# Altium schematic sheet Controller_Sheet.SchDoc
size 420 x 297 mm; SheetNumber: 2; SheetTotal: 4
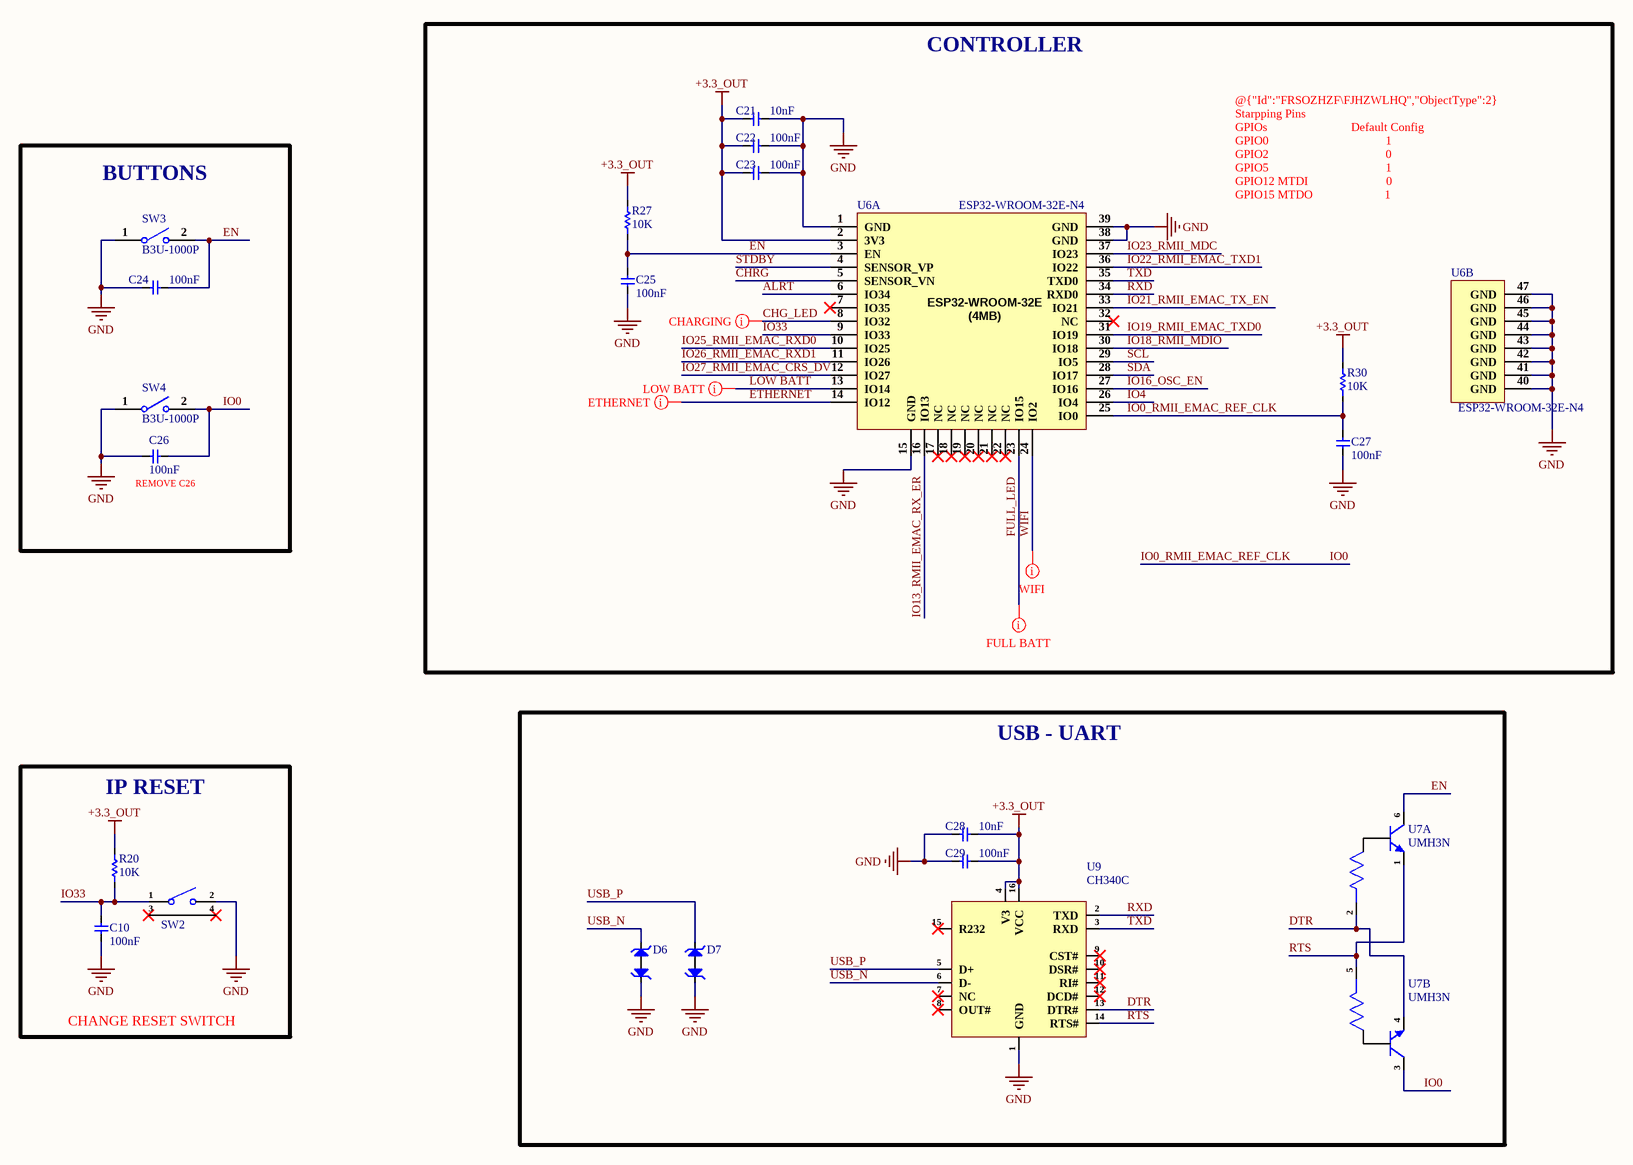
[diagram p0: Controller_Sheet.SchDoc]

## Parts
C10  100nF  [cap-0402]
C21  10nF  [Cap-0402]
C22  100nF  [cap-0402]
C23  100nF  [cap-0402]
C24  100nF  [cap-0402]
C25  100nF  [cap-0402]
C26  100nF  [cap-0402]
C27  100nF  [cap-0402]
C28  10nF  [Cap-0402]
C29  100nF  [cap-0402]
D6  PESD5V0H1BSFYL  [DSN0603-2]  (value not drawn)
D7  PESD5V0H1BSFYL  [DSN0603-2]  (value not drawn)
R20  10K  [Res-0402]
R27  10K  [Res-0402]
R30  10K  [Res-0402]
SW2  1-1825027-4  [1-1825027-4]  (value not drawn)
SW3  B3U-1000P  [B3U-1000P]
SW4  B3U-1000P  [B3U-1000P]
U6  ESP32-WROOM-32E-N4  [38-SMD Module]  (parts A,B of 2)
U7  UMH3N  [SC-70-6_]  (parts A,B of 2)
U9  CH340C  [SOP-16]

## Blocks framed on the sheet
CONTROLLER: C21-C23 C25 C27 R27 R30 U6
BUTTONS: C24 C26 SW3 SW4
USB - UART: C28 C29 D6 D7 U7 U9
IP RESET: C10 R20 SW2

## Nets
+3.3_OUT: C21.2 C22.2 C23.2 C28.1 C29.1 R20.2 R27.2 R30.2 U6.2(3V3) U9.4(V3) U9.16(VCC)
GND: C10.2 C21.1 C22.1 C23.1 C24.2 C25.1 C26.2 C27.1 C28.2 C29.2 D6.1 D7.1 SW2.2 SW3.1 SW4.1 U6.1(GND) U6.15(GND) U6.38(GND) U6.39(GND) U6.40(GND) U6.41(GND) U6.42(GND) U6.43(GND) U6.44(GND) U6.45(GND) U6.46(GND) U6.47(GND) U9.1(GND)
ALRT: U6.6(IO34)
CHG_LED: U6.8(IO32)
CHRG: U6.5(SENSOR_VN)
DTR: U7.2 U7.4(E) U9.13(DTR#)
EN: C24.1 C25.2 R27.1 SW3.2 U6.3(EN) U7.6(C)
ETHERNET: U6.14(IO12)
FULL_LED: U6.23(IO15)
IO0: C26.1 C27.2 R30.1 SW4.2 U6.25(IO0) U7.3(C)  [also labelled IO0_RMII_EMAC_REF_CLK]
IO4: U6.26(IO4)
IO13_RMII_EMAC_RX_ER: U6.16(IO13)
IO16_OSC_EN: U6.27(IO16)
IO18_RMII_MDIO: U6.30(IO18)
IO19_RMII_EMAC_TXD0: U6.31(IO19)
IO21_RMII_EMAC_TX_EN: U6.33(IO21)
IO22_RMII_EMAC_TXD1: U6.36(IO22)
IO23_RMII_MDC: U6.37(IO23)
IO25_RMII_EMAC_RXD0: U6.10(IO25)
IO26_RMII_EMAC_RXD1: U6.11(IO26)
IO27_RMII_EMAC_CRS_DV: U6.12(IO27)
IO33: C10.1 R20.1 SW2.1 U6.9(IO33)
LOW BATT: U6.13(IO14)
RTS: U7.1(E) U7.5 U9.14(RTS#)
RXD: U6.34(RXD0) U9.2(TXD)
SCL: U6.29(IO5)
SDA: U6.28(IO17)
STDBY: U6.4(SENSOR_VP)
TXD: U6.35(TXD0) U9.3(RXD)
USB_N: D6.2 U9.6(D-)
USB_P: D7.2 U9.5(D+)
WIFI: U6.24(IO2)

Not connected (* = marked no-connect by the designer): SW2 3* 4*; U6 7(IO35)* 17(NC)* 18(NC)* 19(NC)* 20(NC)* 21(NC)* 22(NC)* 32(NC)*; U9 7(NC)* 8(OUT#)* 9(CST#)* 10(DSR#)* 11(RI#)* 12(DCD#)* 15(R232)*

## Layout directives
mark named FULL BATT: FULL_LED
mark named LOW BATT: LOW BATT
mark named ETHERNET: ETHERNET
mark named WIFI: WIFI
mark named CHARGING: CHG_LED

## Notes on the sheet
- @{"Id":"FRSOZHZF\FJHZWLHQ","ObjectType":2} Starpping Pins
  GPIOs                            Default Config
  GPIO0                                       1
  GPIO2                                       0
  GPIO5                                       1
  GPIO12 MTDI                          0
  GPIO15 MTDO                        1
- (near C26) REMOVE C26
- CHANGE RESET SWITCH
- PROJECT
- TITLE
- SCALE:
- A3
- SIZE
- FILE NAME
- SHEET
- OF
- REV
- (in symbol ESP32-WROOM-32E-N4, part A) ESP32-WROOM-32E (4MB) /

## Library data of the parts
C10 C22-C27 C29 = C1005X7R1H104KT000F: CAP CER 0.1UF 50V X7R 0402; Manufacturer: TDK; Tolerance: 10%; Voltage: 25V; Item Type: Capacitor; Supplier 1: Avnet; Manufacturer Part Number: C1005X7R1H104KT000F; RoHS: No; Category: Ceramic Capacitors; Dielectric: X7R; Supplier Part Number 1: C1005X7R1H104KT000F; LCSC Part Number: C361198; ComponentLink1Description: LCSC; ComponentLink1URL: https://www.lcsc.com/product-detail/Multilayer-Ceramic-Capacitors-MLCC-SMD-SMT_TDK-C1005X7R1H104KT000F_C361198.html
C21 C28 = CC0402KRX7R8BB103: CAP CER 10000PF 25V X7R 0402; Manufacturer: Yageo; Tolerance: 10%; Item Type: Capacitor; Supplier 1: Digi-Key; Manufacturer Part Number: CC0402KRX7R8BB103; Stock 1: 0; Pricing 1: 1=0.1, 10=0.021, 100=0.0093, 500=0.00666, 1000=0.00523, 2500=0.00476, 5000=0.00438 (USD); Mount: Surface Mount; Case/Package: 0402; Case Code (Metric): 1005; Case Code (Imperial): 0402; Min Operating Temperature: -55°C; Max Operating Temperature: 125°C; Capacitance: 10nF; Dielectric: X7R; Voltage Rating: 25V; Package Quantity: 1; Packaging: Tape and Reel; Voltage Rating (DC): 25V; Termination: SMD/SMT; Composition: Ceramic; Length: 1mm; Height: 0.5mm; Depth: 0.5mm; Width: 0.02inch; Thickness: 0.022inch; Radiation Hardening: No; REACH SVHC: Unknown; Lead Free: Lead Free; Halogen Free: Halogen Free; ComponentLink1URL: http://www.yageo.com/documents/recent/UPY-GPHC_X7R_6.3V-to-50V_18.pdf?src-supplier=Digi-Key; ComponentLink1Description: http://www.yageo.com/documents/recent/UPY-GPHC_X7R_6.3V-to-50V_18.pdf?src-supplier=Digi-Key; ComponentLink2URL: https://www.verical.com/server-webapp/html/getDatasheet?partID=375418&src-supplier=Verical; ComponentLink2Description: https://www.verical.com/server-webapp/html/getDatasheet?partID=375418&src-supplier=Verical; ComponentLink3URL: http://www.yageo.com/documents/recent/UPY-GPHC_X7R_6.3V-to-50V_8.pdf?src-supplier=Avnet; ComponentLink3Description: http://www.yageo.com/documents/recent/UPY-GPHC_X7R_6.3V-to-50V_8.pdf?src-supplier=Avnet; ComponentLink4URL: https://4donline.ihs.com/images/VipMasterIC/IC/YAGO/YAGO-S-A0003557223/YAGO-S-A0003557223-1.pdf?hkey=52A5661711E402568146F3353EA87419&src-supplier=Element14; ComponentLink4Description: https://4donline.ihs.com/images/VipMasterIC/IC/YAGO/YAGO-S-A0003557223/YAGO-S-A0003557223-1.pdf?hkey=52A5661711E402568146F3353EA87419&src-supplier=Element14; ComponentLink5URL: http://www.farnell.com/datasheets/2167236.pdf?src-supplier=Element14; ComponentLink5Description: http://www.farnell.com/datasheets/2167236.pdf?src-supplier=Element14; ComponentLink6URL: http://www.mouser.com/ds/2/447/Yageo_UPY-GP_NP0_16V-to-50V_9-358835.pdf?src-supplier=Mouser; ComponentLink6Description: http://www.mouser.com/ds/2/447/Yageo_UPY-GP_NP0_16V-to-50V_9-358835.pdf?src-supplier=Mouser; Supplier Part Number 1: 311-1337-1-ND; LCSC Part Number: C327025
D6 D7 = PESD5V0H1BSFYL: TVS DIODE 5VWM 6.3VC DSN0603-2; Manufacturer: Nexperia; Supplier 1: Avnet; Manufacturer Part Number: PESD5V0H1BSFYL; RoHS: Yes; Category: ESD and Circuit Protection ICs; Stock 1: 9000; Pricing 1: 18000=0.06453, 36000=0.06278, 54000=0.06104, 90000=0.05930, 180000=0.05755, 900000=0.05581, 1800000=0.05406 (USD); RoHS Compliant: Yes; ComponentLink1URL: http://www.farnell.com/datasheets/1961312.pdf?src-supplier=Farnell; ComponentLink1Description: http://www.farnell.com/datasheets/1961312.pdf?src-supplier=Farnell; ComponentLink2URL: https://assets.nexperia.com/documents/data-sheet/PESD5V0H1BSF.pdf?src-supplier=Digi-Key; ComponentLink2Description: https://assets.nexperia.com/documents/data-sheet/PESD5V0H1BSF.pdf?src-supplier=Digi-Key; ComponentLink3URL: http://www.farnell.com/datasheets/1961312.pdf?src-supplier=Newark; ComponentLink3Description: http://www.farnell.com/datasheets/1961312.pdf?src-supplier=Newark; Supplier Part Number 1: PESD5V0H1BSFYL; LCSC Part Number: C477989; Item Type: Diode
R20 R27 R30 = RC0402FR-0710KL: RES 10K OHM 1% 1/16W 0402; Manufacturer: Yageo; Resistance: 10kR; Voltage Rating (DC): 50V; Temperature Coefficient: 100ppm/°C; Power Rating: 62.5mW; Max Power Dissipation: 63mW; Item Type: Resistor; Supplier 1: Mouser; Manufacturer Part Number: RC0402FR-0710KL; RoHS: Yes; Category: Chip SMD Resistors; Stock 1: 18648329; Pricing 1: 1=0.10000, 10=0.01400, 50=0.01400, 100=0.00500, 1000=0.00300, 10000=0.00200 (USD); Case/Package: 0402; Number of Pins: 2; Case Code (Imperial): 0402; Case Code (Metric): 1005; Min Operating Temperature: -55°C; Max Operating Temperature: 155°C; Resistor Type: Thick Film; Tolerance: 1%; Packaging: Tape and Reel; Voltage Rating: 50V; Termination: SMD/SMT; Working Voltage: 50V; Number of Terminations: 2; Features: Moisture Resistant; Series: RC; Resistance Tolerance: 1%; Construction: Rectangular; Length: 1mm; Width: 0.5mm; Height: 0.32mm; Depth: 0.5mm; Lead Pitch: 0.2mm; REACH SVHC: No SVHC; Lead Free: Lead Free; RoHS Compliant: Yes; Military Standard: Not; ComponentLink1URL: https://datasheet.ciiva.com/7660/38568-7660787.pdf?src-supplier=Element14; ComponentLink1Description: https://datasheet.ciiva.com/7660/38568-7660787.pdf?src-supplier=Element14; ComponentLink2URL: https://datasheet.ciiva.com/7849/1686128-7849814.pdf?src-supplier=Element14; ComponentLink2Description: https://datasheet.ciiva.com/7849/1686128-7849814.pdf?src-supplier=Element14; ComponentLink3URL: https://datasheet.ciiva.com/7983/1018594-7983486.pdf?src-supplier=Element14; ComponentLink3Description: https://datasheet.ciiva.com/7983/1018594-7983486.pdf?src-supplier=Element14; ComponentLink4URL: https://datasheet.ciiva.com/22747/1018594-22747512.pdf?src-supplier=Element14; ComponentLink4Description: https://datasheet.ciiva.com/22747/1018594-22747512.pdf?src-supplier=Element14; ComponentLink5URL: https://datasheet.ciiva.com/12667/pyu-rc0402-51-rohs-l-6-r-12667067.pdf?src-supplier=Mouser; ComponentLink5Description: https://datasheet.ciiva.com/12667/pyu-rc0402-51-rohs-l-6-r-12667067.pdf?src-supplier=Mouser; ComponentLink6URL: https://datasheet.ciiva.com/7849/1784430-7849813.pdf?src-supplier=Element14; ComponentLink6Description: https://datasheet.ciiva.com/7849/1784430-7849813.pdf?src-supplier=Element14; ComponentLink7URL: https://datasheet.ciiva.com/7849/1784430-7849815.pdf?src-supplier=Element14; ComponentLink7Description: https://datasheet.ciiva.com/7849/1784430-7849815.pdf?src-supplier=Element14; Supplier Part Number 1: 603-RC0402FR-0710KL; LCSC Part Number: C60490
SW2 = 1-1825027-4: With Bracket 50mA Round Button Right Angle SPST 100,000 Cycles 1.6N 24V Through Hole Tactile Switches ROHS; Manufacturer: TE Connectivity; Manufacturer Part Number: 1-1825027-4; LCSC Part Number: C2928195; Item Type: Tactile Switch; Package: Through Hole; ComponentLink1Description: LCSC Link; ComponentLink1URL: https://lcsc.com/product-detail/Tactile-Switches_TE-Connectivity-1-1825027-4_C2928195.html
SW3 SW4 = B3U-1000P: SWITCH TACTILE SPST-NO 0.05A 12V; Manufacturer: Omron; Mechanical Life: 200000Cycles; Operating Force: 1.5N; Throw Configuration: SPST; Current Rating: 50mA; Contact Resistance: 100mR; Illumination Type: Non-Illuminated,Illuminated; Switch Travel: 0.15mm; Switch Function: Off-Mom; Actuator Type: Standard; Actuator Length: 0.4mm; Ratings: Dust Proof,IP40; ComponentLink1URL: http://www.farnell.com/datasheets/60838.pdf?src-supplier=Farnell; ComponentLink1Description: http://www.farnell.com/datasheets/60838.pdf?src-supplier=Farnell; ComponentLink2URL: http://www.farnell.com/datasheets/60838.pdf?src-supplier=Element14; ComponentLink2Description: http://www.farnell.com/datasheets/60838.pdf?src-supplier=Element14; ComponentLink3URL: https://omronfs.omron.com/en_US/ecb/products/pdf/en-b3u.pdf?src-supplier=Digi-Key; ComponentLink3Description: https://omronfs.omron.com/en_US/ecb/products/pdf/en-b3u.pdf?src-supplier=Digi-Key; ComponentLink4URL: http://www.omron.com/ecb/products/pdf/en-b3u.pdf?src-supplier=Digi-Key; ComponentLink4Description: http://www.omron.com/ecb/products/pdf/en-b3u.pdf?src-supplier=Digi-Key; ComponentLink5URL: https://www.distrelec.biz/Web/Downloads/he/et/B3U_eng_datasheet.pdf?mime=application%2Fpdf&src-supplier=Distrelec; ComponentLink5Description: https://www.distrelec.biz/Web/Downloads/he/et/B3U_eng_datasheet.pdf?mime=application%2Fpdf&src-supplier=Distrelec; ComponentLink6URL: http://www.onlinecomponents.com/productFiles/mf-OM/en-b3u.pdf?src-supplier=Onlinecomponents.com; ComponentLink6Description: http://www.onlinecomponents.com/productFiles/mf-OM/en-b3u.pdf?src-supplier=Onlinecomponents.com; Supplier 1: Digi-Key; Manufacturer Part Number: B3U-1000P; Stock 1: 116454; Pricing 1: 1=1, 10=0.961, 25=0.9064, 50=0.7976, 100=0.7251, 250=0.68888, 500=0.67074, 1000=0.52571 (USD); Mount: Surface Mount; Weight: 0.000776oz; Contact Material: Silver; Min Operating Temperature: -25°C; Max Operating Temperature: 70°C; Packaging: Tape and Reel; Voltage Rating (DC): 12V; Package Quantity: 1; Max Current Rating: 50mA; Termination: SMD/SMT; Orientation: Straight; Max Voltage Rating (DC): 12V; Electrical Life: 200000Cycles; Insulation Resistance: 100MR; Contact Current Rating: 50mA; Length: 4mm; Height: 1.2mm; Depth: 2.5mm; Width: 3mm; REACH SVHC: Unknown; Lead Free: Lead Free; ComponentLink7URL: https://www.verical.com/server-webapp/html/getDatasheet?partID=552554&src-supplier=Verical; ComponentLink7Description: https://www.verical.com/server-webapp/html/getDatasheet?partID=552554&src-supplier=Verical; ComponentLink8URL: http://www.farnell.com/datasheets/1685550.pdf?src-supplier=Element14; ComponentLink8Description: http://www.farnell.com/datasheets/1685550.pdf?src-supplier=Element14; ComponentLink9URL: http://www.farnell.com/datasheets/2610940.pdf?src-supplier=Farnell; ComponentLink9Description: http://www.farnell.com/datasheets/2610940.pdf?src-supplier=Farnell; ComponentLink10URL: https://www.alliedelec.com/m/d/4c8a9ef82804fc3c241a13c1e298fd73.pdf?src-supplier=Allied+Electronics; ComponentLink10Description: https://www.alliedelec.com/m/d/4c8a9ef82804fc3c241a13c1e298fd73.pdf?src-supplier=Allied+Electronics; Supplier Part Number 1: SW1020DKR-ND; LCSC Part Number: C231329; Item Type: Switch
U6 = ESP32-WROOM-32E-N4: RX TXRX MOD WIFI TRACE ANT SMD; Manufacturer: Espressif Systems; Supplier 1: Digi-Key; Manufacturer Part Number: ESP32-WROOM-32E-N4; RoHS: No; Pricing 1: 1=3.00000 (USD); Supplier Part Number 1: 1965-ESP32-WROOM-32E(4MB)CT-ND; LCSC Part Number: C701341; ComponentLink1Description: LCSC Link; ComponentLink1URL: https://lcsc.com/product-detail/WiFi-Modules_ESPRESSIF-ESP32-WROOM-32E-N4_C701341.html
U7 = UMH3N: 2 NPN pre-biased (Dual) 150mW 100mA 50V SC-70-6(SOT-363) Digital Transistors ROHS; Manufacturer: Changjiang; Manufacturer Part Number: UMH3N; Footprint: SC-70-6(SOT-363); ComponentLink1Description: LCSC; ComponentLink1URL: https://www.lcsc.com/product-detail/Digital-Transistors_Jiangsu-Changjing-Electronics-Technology-Co-Ltd-UMH3N_C62892.html; LCSC Part Number: C62892; Item Type: Transistor
U9 = CH340C: 2Mbps Transceiver USB 2.0 SOP-16 USB ICs ROHS; Manufacturer: WCH; Item Type: IC; Manufacturer Part Number: CH340C; Package: SOP-16; LCSC Part Number: C84681; ComponentLink1Description: LCSC; ComponentLink1URL: https://www.lcsc.com/product-detail/USB-ICs_WCH-Jiangsu-Qin-Heng-CH340C_C84681.html